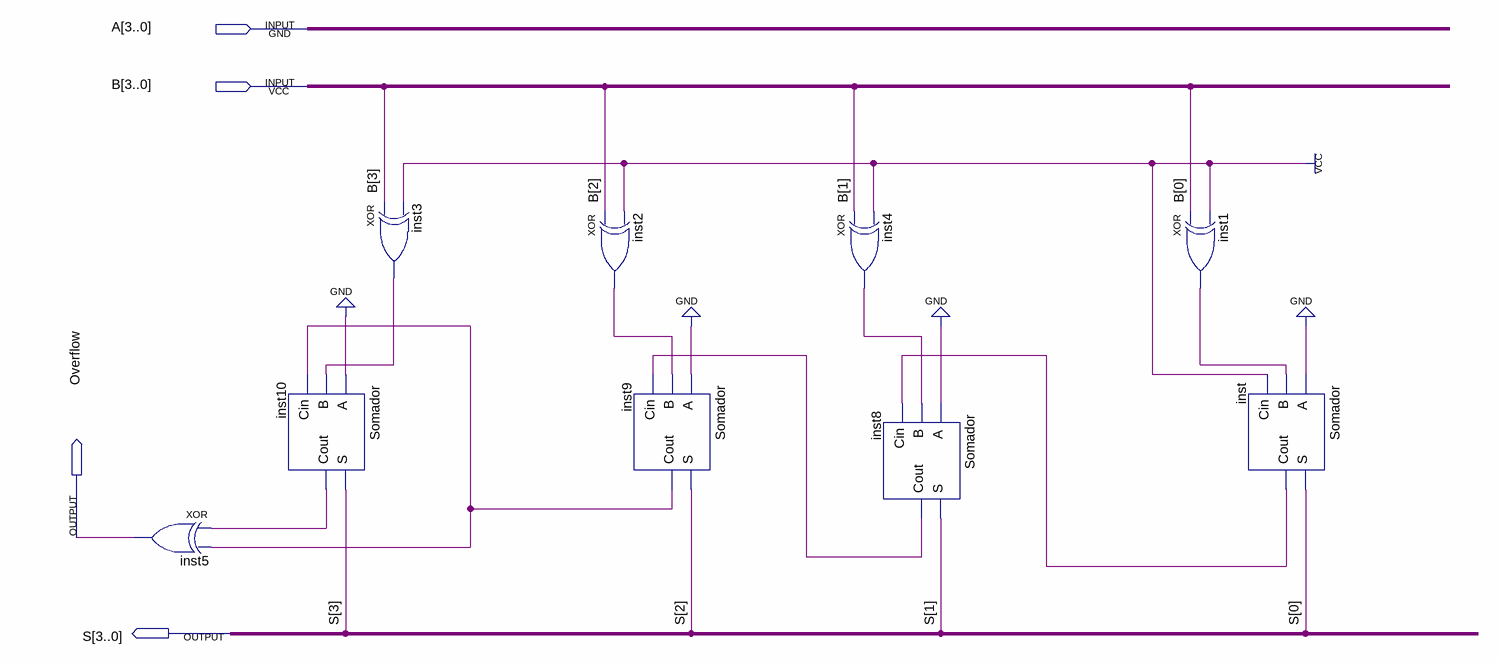
[diagram p0: schematic sheet]
// Quartus schematic Comp2.bdf as structural Verilog: 9 symbols, 4 pins
module Comp2 (
  input  [3:0] A,
  input  [3:0] B,
  output Overflow,
  output [3:0] S
);

  wire inst1_out, inst2_out, inst3_out, inst4_out, inst8_cout, inst9_cout, inst10_cout, inst_cout;

  xor inst5 (Overflow, inst10_cout, inst9_cout);
  Somador inst10 (.A(1'b0), .B(inst3_out), .Cin(inst9_cout), .S(S[3]), .Cout(inst10_cout));
  xor inst3 (inst3_out, B[3], 1'b1);
  xor inst2 (inst2_out, B[2], 1'b1);
  Somador inst9 (.A(1'b0), .B(inst2_out), .Cin(inst8_cout), .S(S[2]), .Cout(inst9_cout));
  xor inst4 (inst4_out, B[1], 1'b1);
  Somador inst8 (.A(1'b0), .B(inst4_out), .Cin(inst_cout), .S(S[1]), .Cout(inst8_cout));
  xor inst1 (inst1_out, B[0], 1'b1);
  Somador inst (.A(1'b0), .B(inst1_out), .Cin(1'b1), .S(S[0]), .Cout(inst_cout));
endmodule
